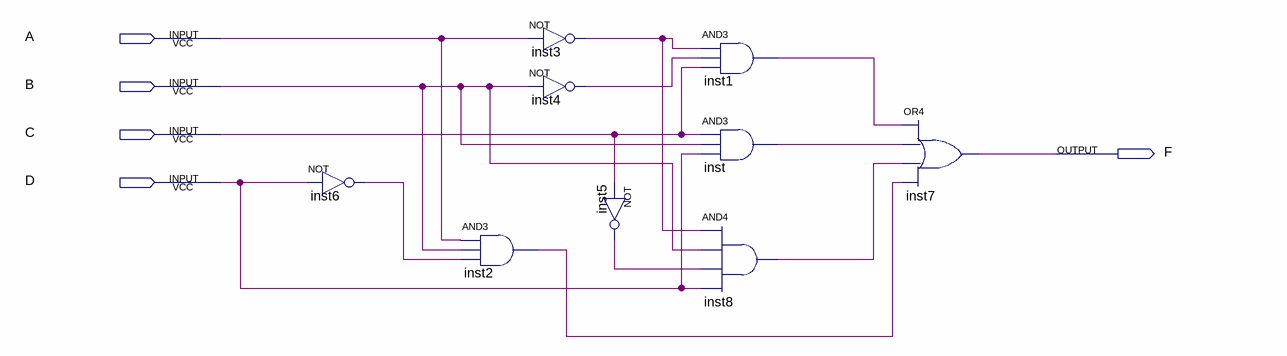
[diagram p0: schematic sheet]
// Quartus schematic LAB02_Cau1.bdf as structural Verilog: 9 symbols, 5 pins
module LAB02_Cau1 (
  input  A,
  input  B,
  input  C,
  input  D,
  output F
);

  wire inst1_out, inst2_out, inst3_out, inst4_out, inst5_out, inst6_out, inst8_out, inst_out;

  not inst6 (inst6_out, D);
  and inst2 (inst2_out, A, B, inst6_out);
  not inst3 (inst3_out, A);
  not inst4 (inst4_out, B);
  not inst5 (inst5_out, C);
  and inst1 (inst1_out, inst3_out, inst4_out, C);
  and inst (inst_out, C, B, D);
  and inst8 (inst8_out, inst3_out, B, inst5_out, D);
  or inst7 (F, inst1_out, inst_out, inst8_out, inst2_out);
endmodule
